# Altium schematic sheet SkalaMiljanLjubicaPredajnik.SchDoc
size A
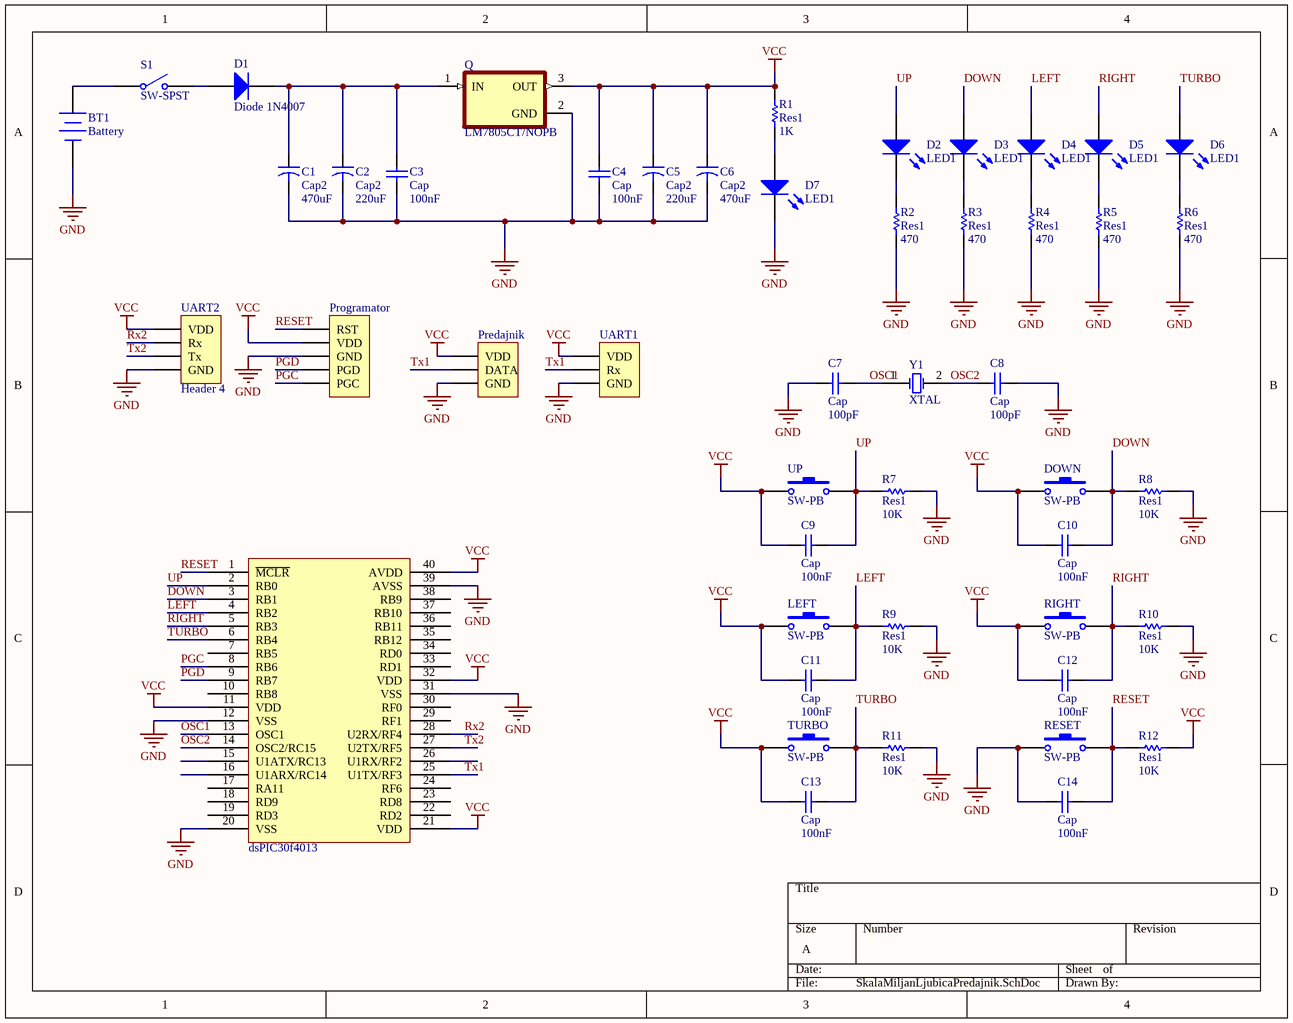
[diagram p0: SkalaMiljanLjubicaPredajnik.SchDoc]

## Parts
?  dsPIC30f4013  [DIP254P1524X635-40]
BT1  Battery  [BAT-2]
C1  Cap2  value 470uF  [CAPR5-4X5]
C2  Cap2  value 220uF  [CAPR5-4X5]
C3  Cap  value 100nF  [RAD-0.3]
C4  Cap  value 100nF  [RAD-0.3]
C5  Cap2  value 220uF  [CAPR5-4X5]
C6  Cap2  value 470uF  [CAPR5-4X5]
C7  Cap  value 100pF  [RAD-0.3]
C8  Cap  value 100pF  [RAD-0.3]
C9  Cap  value 100nF  [RAD-0.3]
C10  Cap  value 100nF  [RAD-0.3]
C11  Cap  value 100nF  [RAD-0.3]
C12  Cap  value 100nF  [RAD-0.3]
C13  Cap  value 100nF  [RAD-0.3]
C14  Cap  value 100nF  [RAD-0.3]
D1  Diode 1N4007  [DO-41]
D2  LED1  [LED-1]
D3  LED1  [LED-1]
D4  LED1  [LED-1]
D5  LED1  [LED-1]
D6  LED1  [LED-1]
D7  LED1  [LED-1]
DOWN  SW-PB  [SPST-2]
LEFT  SW-PB  [SPST-2]
Predajnik  Header 3  [HDR1X3]  (value not drawn)
Programator  Header 5  [HDR1X5]  (value not drawn)
Q  LM7805CT/NOPB  [TO254P1054X470X2600-3]
R1  Res1  value 1K  [AXIAL-0.3]
R2  Res1  value 470  [AXIAL-0.3]
R3  Res1  value 470  [AXIAL-0.3]
R4  Res1  value 470  [AXIAL-0.3]
R5  Res1  value 470  [AXIAL-0.3]
R6  Res1  value 470  [AXIAL-0.3]
R7  Res1  value 10K  [AXIAL-0.3]
R8  Res1  value 10K  [AXIAL-0.3]
R9  Res1  value 10K  [AXIAL-0.3]
R10  Res1  value 10K  [AXIAL-0.3]
R11  Res1  value 10K  [AXIAL-0.3]
R12  Res1  value 10K  [AXIAL-0.3]
RESET  SW-PB  [SPST-2]
RIGHT  SW-PB  [SPST-2]
S1  SW-SPST  [SPST-2]
TURBO  SW-PB  [SPST-2]
UART1  Header 3  [HDR1X3]  (value not drawn)
UART2  Header 4  [HDR1X4]
UP  SW-PB  [SPST-2]
Y1  XTAL  [R38]

## Nets
GND: ?.12(VSS) ?.20(VSS) ?.31(VSS) ?.39(AVSS) BT1.2(-) C1.2 C2.2 C3.1 C4.1 C5.2 C6.2 C7.1 C8.2 C14.1 D7.2(K) Predajnik.3(GND) Programator.3(GND) Q.2(GND) R2.1 R3.1 R4.1 R5.1 R6.1 R7.2 R8.2 R9.2 R10.2 R11.2 RESET.1 UART1.3(GND) UART2.4(GND)
VCC: ?.11(VDD) ?.21(VDD) ?.32(VDD) ?.40(AVDD) C4.2 C5.1 C6.1 C9.1 C10.1 C11.1 C12.1 C13.1 DOWN.1 LEFT.1 Predajnik.1(VDD) Programator.2(VDD) Q.3(OUT) R1.2 R12.2 RIGHT.1 TURBO.1 UART1.1(VDD) UART2.1(VDD) UP.1
DOWN: ?.3(RB1) C10.2 D3.1(A) DOWN.2 R8.1
LEFT: ?.4(RB2) C11.2 D4.1(A) LEFT.2 R9.1
OSC1: ?.13(OSC1) C7.2 Y1.1(OSC1)
OSC2: ?.14(OSC2/RC15) C8.1 Y1.2(OSC2)
PGC: ?.8(RB6) Programator.5(PGC)
PGD: ?.9(RB7) Programator.4(PGD)
RESET: ?.1(~{MCLR}) C14.2 Programator.1(RST) R12.1 RESET.2
RIGHT: ?.5(RB3) C12.2 D5.1(A) R10.1 RIGHT.2
Rx2: ?.28(U2RX/RF4) UART2.2(Rx)
TURBO: ?.6(RB4) C13.2 D6.1(A) R11.1 TURBO.2
Tx1: ?.25(U1TX/RF3) Predajnik.2(DATA) UART1.2(Rx)
Tx2: ?.27(U2TX/RF5) UART2.3(Tx)
UP: ?.2(RB0) C9.2 D2.1(A) R7.1 UP.2
NetBT1_1: BT1.1(+) S1.1(COMMON)
NetC1_1: C1.1 C2.1 C3.2 D1.2(K) Q.1(IN)
NetD1_1: D1.1(A) S1.2(NO)
NetD2_2: D2.2(K) R2.2
NetD3_2: D3.2(K) R3.2
NetD4_2: D4.2(K) R4.2
NetD5_2: D5.2(K) R5.2
NetD6_2: D6.2(K) R6.2
NetD7_1: D7.1(A) R1.1

Not connected (* = marked no-connect by the designer): ? 7(RB5) 10(RB8) 15(U1ATX/RC13) 16(U1ARX/RC14) 17(RA11) 18(RD9) 19(RD3) 22(RD2) 23(RD8) 24(RF6) 26(U1RX/RF2) 29(RF1) 30(RF0) 33(RD1) 34(RD0) 35(RB12) 36(RB11) 37(RB10) 38(RB9)

## Library data of the parts
BT1 = Battery: Multicell Battery; Published: 24-Mar-1999; LatestRevisionDate: 17-Jul-2002; LatestRevisionNote: Re-released for DXP Platform.; PackageReference: BAT-2; Publisher: Altium Limited; PackageDescription: Battery; 2 Leads
C1 C2 C5 C6 = Cap2: Capacitor; Published: 23-Sep-2002; PackageReference: CAPR5-4X5; Publisher: Altium Limited; PackageDescription: Capacitor; 2 Leads
C3 C4 C7-C14 = Cap: Capacitor; Published: 8-Jun-2000; LatestRevisionDate: 17-Jul-2002; LatestRevisionNote: Re-released for DXP Platform.; PackageReference: RAD-0.3; Publisher: Altium Limited; PackageDescription: Radial Cap, Thru-Hole; 2 Leads; 0.3 in Pin Spacing
D1 = Diode 1N4007: 1 Amp General Purpose Rectifier; Published: 8-Jun-2000; LatestRevisionDate: 17-Jul-2002; LatestRevisionNote: Re-released for DXP Platform.; DatasheetVersion: 1998; PackageVersion: Aug-1999; PackageReference: DO-41; Publisher: Altium Limited; PackageDescription: Diode, Axial; Body 5.2 x 2.7 mm (LxDia. max), Lead Dia. 0.86 mm (max); Code_JEDEC: DO-204-AL; ComponentLink1Description: Manufacturer Link; ComponentLink1URL: http://www.fairchildsemi.com/; ComponentLink2Description: Datasheet; ComponentLink2URL: http://www.fairchildsemi.com/ds/1N%2F1N4001.pdf
D2-D7 = LED1: Typical RED GaAs LED; Published: 8-Jun-2000; LatestRevisionDate: 08-Jul-2005; LatestRevisionNote: Mech Layer 1 removed.; PackageReference: LED-1; Publisher: Altium Limited; PackageDescription: LED; 2 Leads
DOWN LEFT RESET RIGHT TURBO UP = SW-PB: Switch; Published: 24-Mar-1999; LatestRevisionDate: 17-Jul-2002; LatestRevisionNote: Re-released for DXP Platform.; PackageReference: SPST-2; Publisher: Altium Limited; PackageDescription: Switch; 2 Leads
Predajnik UART1 = Header 3: Header, 3-Pin; LatestRevisionDate: 17-Jul-2002; LatestRevisionNote: Re-released for DXP Platform.; Publisher: Altium Limited
Programator = Header 5: Header, 5-Pin; LatestRevisionDate: 17-Jul-2002; LatestRevisionNote: Re-released for DXP Platform.; Publisher: Altium Limited
Q = LM7805CT/NOPB: Linear Voltage Regulator IC 1 Output 1A TO-220-3; MF: ON Semiconductor; MP: LM7805CT; SnapEDA_Link: https://www.snapeda.com/parts/LM7805CT/ON%20Semiconductor/view-part/546231/?ref=snap; Price: None; Package: TO-220 ON Semiconductor; Value: *; Availability: Unavailable
R1-R12 = Res1: Resistor; Published: 8-Jun-2000; LatestRevisionDate: 17-Jul-2002; LatestRevisionNote: Re-released for DXP Platform.; PackageReference: AXIAL-0.3; Publisher: Altium Limited; PackageDescription: Axial Device, Thru-Hole; 2 Leads; 0.3 in Pin Spacing
S1 = SW-SPST: Single-Pole, Single-Throw Switch; Published: 24-Mar-1999; LatestRevisionDate: 17-Jul-2002; LatestRevisionNote: Re-released for DXP Platform.; PackageReference: SPST-2; Publisher: Altium Limited; PackageDescription: Switch; 2 Leads
UART2 = Header 4: Header, 4-Pin; LatestRevisionDate: 17-Jul-2002; LatestRevisionNote: Re-released for DXP Platform.; Publisher: Altium Limited
Y1 = XTAL: Crystal Oscillator; Published: 8-Jun-2000; LatestRevisionDate: 17-Jul-2002; LatestRevisionNote: Re-released for DXP Platform.; PackageReference: R38; Publisher: Altium Limited; PackageDescription: Crystal, Thru-Hole; 2 Leads; Body 3.1 x 8.2 mm (Dia.xH)